# EAGLE design ProtoShieldMegaU (EAGLE 5.10)
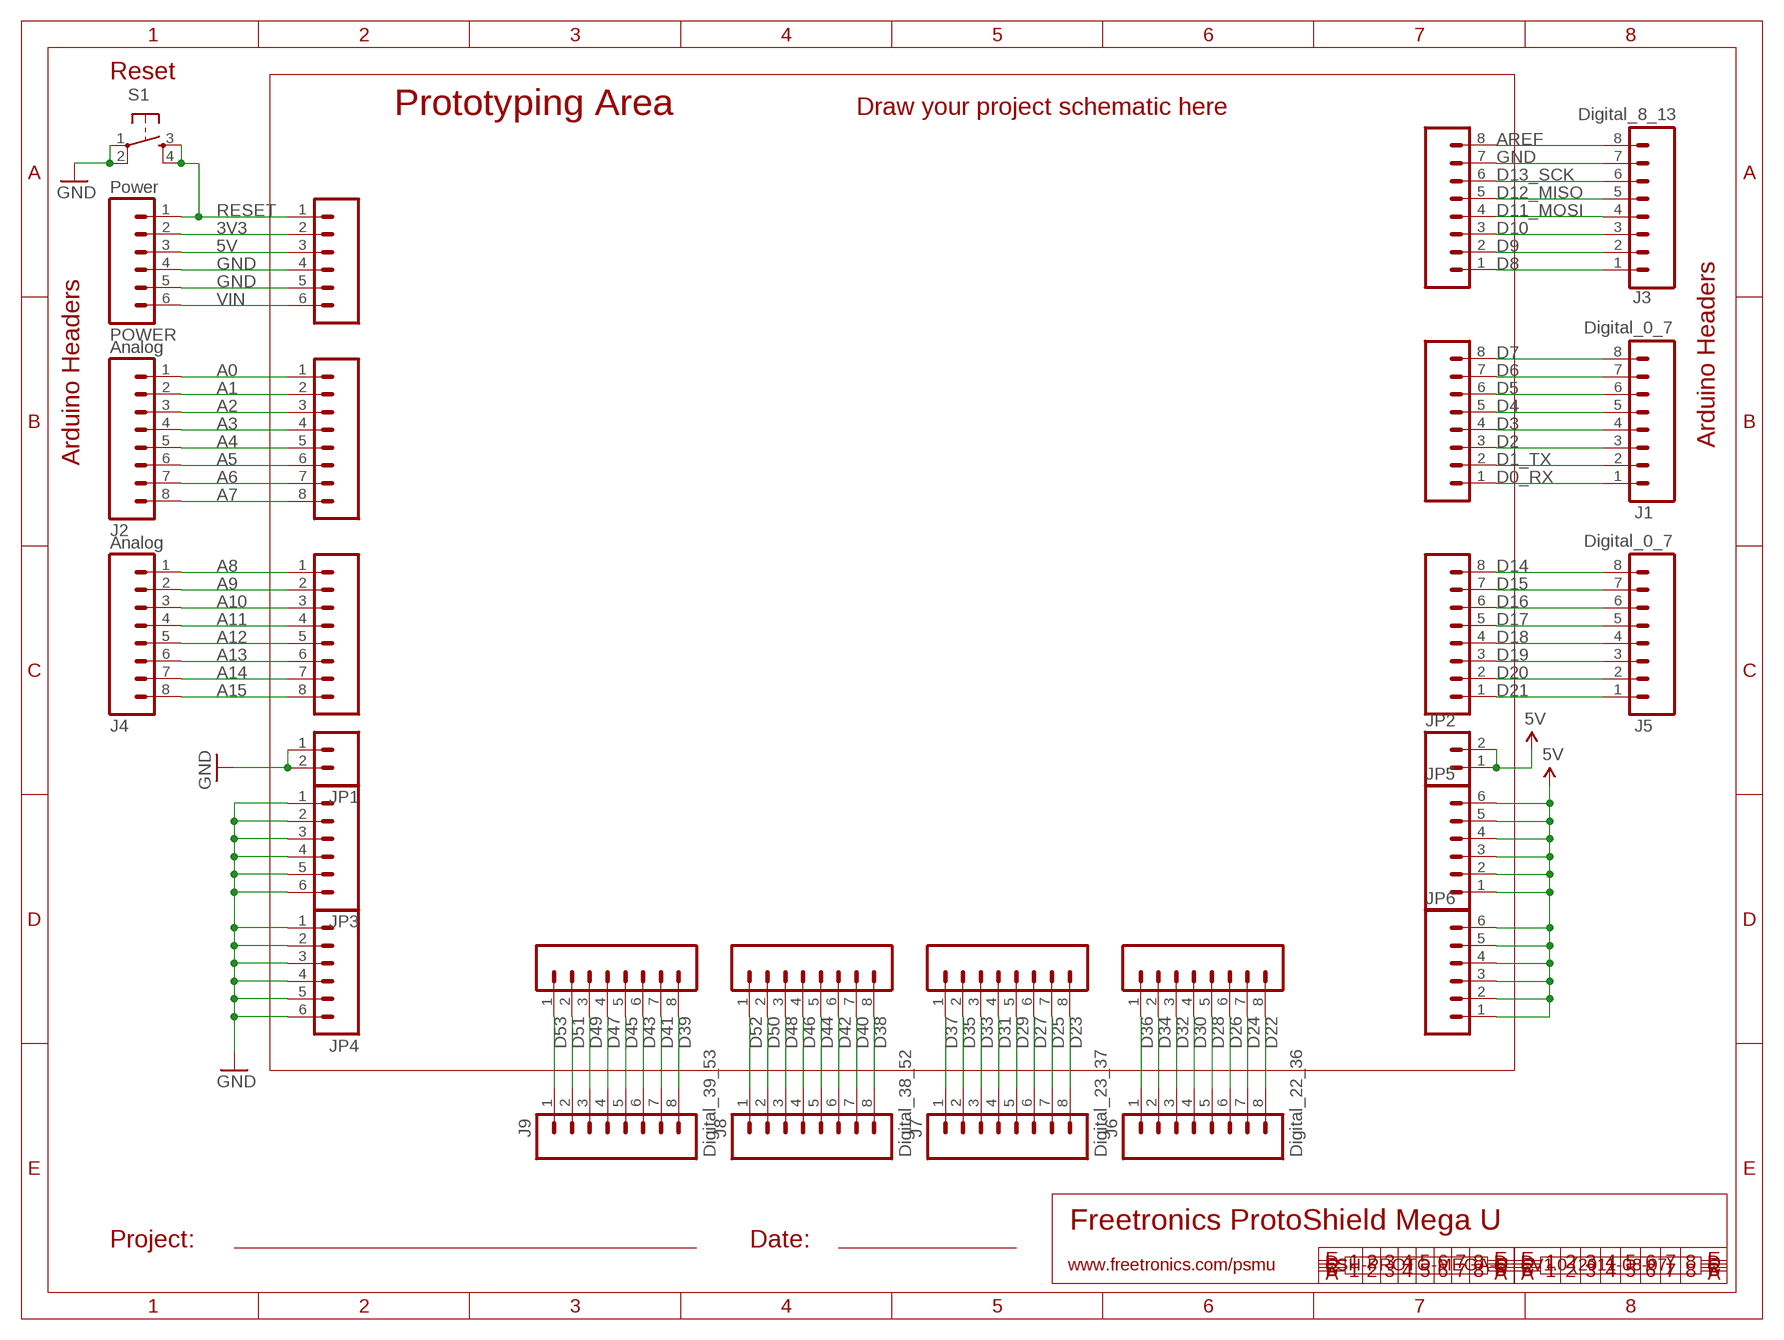
[diagram p0: schematic, sheet 1]

## Parts
J1  Digital_0_7  M08  [1X08]
J2  Analog  M08  [1X08]
J3  Digital_8_13  M08  [1X08]
J4  Analog  M08  [1X08]
J5  Digital_0_7  M08  [1X08]
J6  Digital_22_36  M08  [1X08]
J7  Digital_23_37  M08  [1X08]
J8  Digital_38_52  M08  [1X08]
J9  Digital_39_53  M08  [1X08]
JP1  M02PTH  [1X02]
JP2  M02PTH  [1X02]
JP3  M06SIP  [1X06]
JP4  M06SIP  [1X06]
JP5  M06SIP  [1X06]
JP6  M06SIP  [1X06]
POWER  Power  M06SIP  [1X06]
S1  TAC_SWITCHPTH  [TACTILE-PTH]
SL1  Digital_0_7  M08  [1X08]
SL2  Analog  M08  [1X08]
SL3  Digital_8_13  M08  [1X08]
SL4  Analog  M08  [1X08]
SL5  Digital_0_7  M08  [1X08]
SL6  Digital_0_7  M08  [1X08]
SL7  Digital_0_7  M08  [1X08]
SL8  Digital_0_7  M08  [1X08]
SL9  Digital_0_7  M08  [1X08]
SLP  Power  M06SIP  [1X06]

## Nets
3V3: POWER.2 SLP.2
5V: JP2.1 JP2.2 JP5.1 JP5.2 JP5.3 JP5.4 JP5.5 JP5.6 JP6.1 JP6.2 JP6.3 JP6.4 JP6.5 JP6.6 POWER.3 SLP.3
A0: J2.1 SL2.1
A1: J2.2 SL2.2
A2: J2.3 SL2.3
A3: J2.4 SL2.4
A4: J2.5 SL2.5
A5: J2.6 SL2.6
A6: J2.7 SL2.7
A7: J2.8 SL2.8
A8: J4.1 SL4.1
A9: J4.2 SL4.2
A10: J4.3 SL4.3
A11: J4.4 SL4.4
A12: J4.5 SL4.5
A13: J4.6 SL4.6
A14: J4.7 SL4.7
A15: J4.8 SL4.8
AREF: J3.8 SL3.8
D0_RX: J1.1 SL1.1
D1_TX: J1.2 SL1.2
D2: J1.3 SL1.3
D3: J1.4 SL1.4
D4: J1.5 SL1.5
D5: J1.6 SL1.6
D6: J1.7 SL1.7
D7: J1.8 SL1.8
D8: J3.1 SL3.1
D9: J3.2 SL3.2
D10: J3.3 SL3.3
D11_MOSI: J3.4 SL3.4
D12_MISO: J3.5 SL3.5
D13_SCK: J3.6 SL3.6
D14: J5.8 SL5.8
D15: J5.7 SL5.7
D16: J5.6 SL5.6
D17: J5.5 SL5.5
D18: J5.4 SL5.4
D19: J5.3 SL5.3
D20: J5.2 SL5.2
D21: J5.1 SL5.1
D22: J6.8 SL6.8
D23: J7.8 SL7.8
D24: J6.7 SL6.7
D25: J7.7 SL7.7
D26: J6.6 SL6.6
D27: J7.6 SL7.6
D28: J6.5 SL6.5
D29: J7.5 SL7.5
D30: J6.4 SL6.4
D31: J7.4 SL7.4
D32: J6.3 SL6.3
D33: J7.3 SL7.3
D34: J6.2 SL6.2
D35: J7.2 SL7.2
D36: J6.1 SL6.1
D37: J7.1 SL7.1
D38: J8.8 SL8.8
D39: J9.8 SL9.8
D40: J8.7 SL8.7
D41: J9.7 SL9.7
D42: J8.6 SL8.6
D43: J9.6 SL9.6
D44: J8.5 SL8.5
D45: J9.5 SL9.5
D46: J8.4 SL8.4
D47: J9.4 SL9.4
D48: J8.3 SL8.3
D49: J9.3 SL9.3
D50: J8.2 SL8.2
D51: J9.2 SL9.2
D52: J8.1 SL8.1
D53: J9.1 SL9.1
GND: J3.7 JP1.1 JP1.2 JP3.1 JP3.2 JP3.3 JP3.4 JP3.5 JP3.6 JP4.1 JP4.2 JP4.3 JP4.4 JP4.5 JP4.6 POWER.4 POWER.5 S1.1 S1.2 SL3.7 SLP.4 SLP.5
RESET: POWER.1 S1.3 S1.4 SLP.1
VIN: POWER.6 SLP.6

## Notes on the sheet
- Reset
- Prototyping Area | Draw your project schematic here
- Arduino Headers
- Arduino Headers
- Freetronics ProtoShield Mega U
- Project: | Date:
- www.freetronics.com/psmu | SH-PROTO-MEGA-U | V1.0 (2011-08-07)

## Library data of the parts
J1 J3 J5-J9 SL1 SL3 SL5-SL9 = freetronics:M08: Header 8 Standard 8-pin 0.1" header. Use with straight break away headers (SKU : PRT-00116), right angle break away headers (PRT-00553), swiss pins (PRT-00743), machine pins (PRT-00117), and female headers (PRT-00115).
J2 J4 SL2 SL4 = freetronics-master-v1:M08: Header 8 Standard 8-pin 0.1" header. Use with straight break away headers (SKU : PRT-00116), right angle break away headers (PRT-00553), swiss pins (PRT-00743), machine pins (PRT-00117), and female headers (PRT-00115).
JP1 JP2 = freetronics-master-v1:M02: Header 2 Standard 2-pin 0.1" header. Use with straight break away headers (SKU : PRT-00116), right angle break away headers (PRT-00553), swiss pins (PRT-00743), machine pins (PRT-00117), and female headers (PRT-00115). Molex polarized connector foot print use with SKU : PRT-08233 with associated crimp pins and housings.
JP3-JP6 = freetronics-master-v1:M06: Header 6 Standard 6-pin 0.1" header. Use with straight break away headers (SKU : PRT-00116), right angle break away headers (PRT-00553), swiss pins (PRT-00743), machine pins (PRT-00117), and female headers (PRT-00115). Molex polarized connector foot print use with SKU : PRT-08094 with associated crimp pins and housings. NOTES ON THE VARIANTS LOCK and LOCK_LONGPADS... This footprint was designed to help hold the alignment of a through-hole component (i.e. 6-pin header) while soldering it into place. You may notice that each hole has been shifted either up or down by 0.005 of an inch from it's more standard position (which is a perfectly straight line). This slight alteration caused the pins (the squares in the middle) to touch the edges of the holes. Because they are alternating, it causes a "brace" to hold the component in place. 0.005 has proven to be the perfect amount of "off-center" position when using our standard breakaway headers. Although looks a little odd when you look at the bare footprint, once you have a header in there, the alteration is very hard to notice. Also, if you push a header all the way into place, it is covered up entirely on the bottom side. This idea of altering the position of holes to aid alignment will be further integrated into the Sparkfun Library for other footprints. It can help hold any component with 3 or more connection pins.
POWER SLP = freetronics:M06: Header 6 Standard 6-pin 0.1" header. Use with straight break away headers (SKU : PRT-00116), right angle break away headers (PRT-00553), swiss pins (PRT-00743), machine pins (PRT-00117), and female headers (PRT-00115). Molex polarized connector foot print use with SKU : PRT-08094 with associated crimp pins and housings. NOTES ON THE VARIANTS LOCK and LOCK_LONGPADS... This footprint was designed to help hold the alignment of a through-hole component (i.e. 6-pin header) while soldering it into place. You may notice that each hole has been shifted either up or down by 0.005 of an inch from it's more standard position (which is a perfectly straight line). This slight alteration caused the pins (the squares in the middle) to touch the edges of the holes. Because they are alternating, it causes a "brace" to hold the component in place. 0.005 has proven to be the perfect amount of "off-center" position when using our standard breakaway headers. Although looks a little odd when you look at the bare footprint, once you have a header in there, the alteration is very hard to notice. Also, if you push a header all the way into place, it is covered up entirely on the bottom side. This idea of altering the position of holes to aid alignment will be further integrated into the Sparkfun Library for other footprints. It can help hold any component with 3 or more connection pins.
S1 = freetronics-master-v1:TAC_SWITCH: Momentary Switch Button commonly used for reset or general input. Spark Fun Electronics SKU : COM-00097

## Board
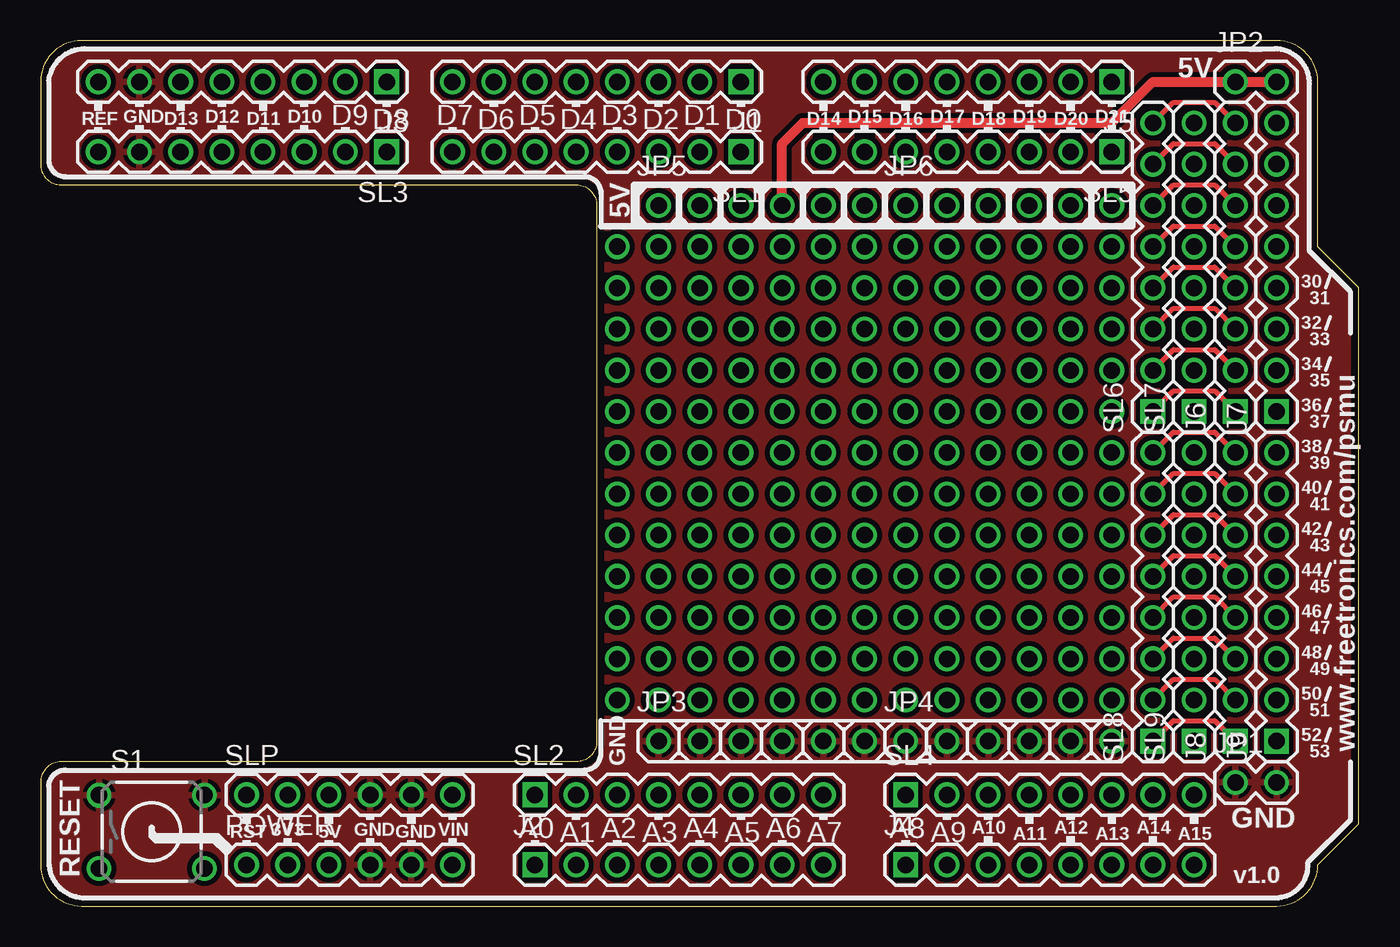
[diagram p1: board, top side]
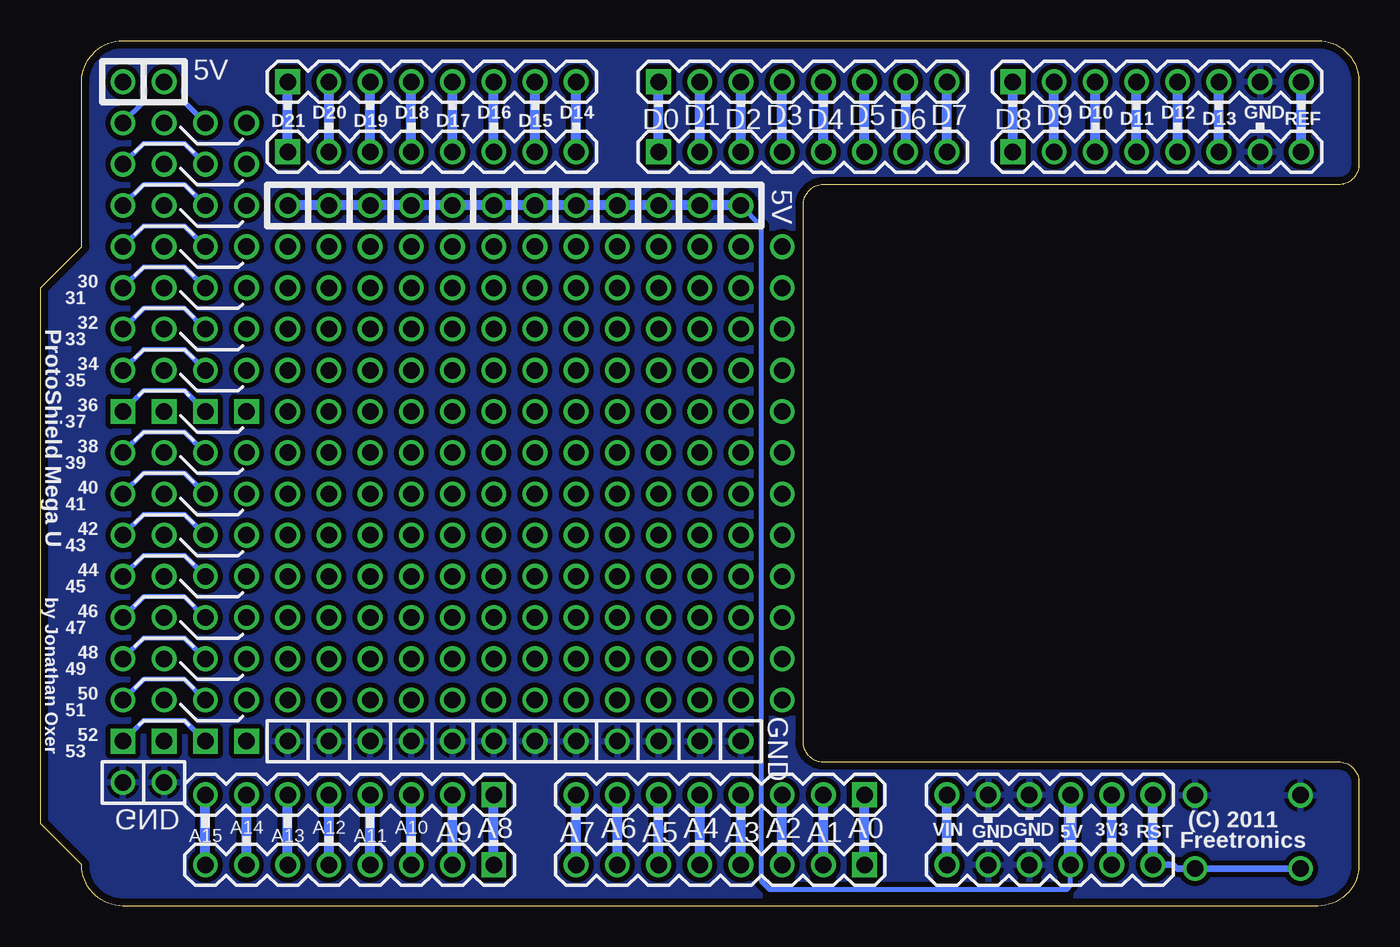
[diagram p2: board, bottom side, seen from below]

Size 81.28 x 53.34 mm. Coordinates in mm from the lower left corner, seen from the top.
Outline: 0,2.54 arc90 2.54,0 76.2,0 arc90 78.74,2.54 81.28,5.08 81.28,38.1 78.74,40.64 78.74,50.8 arc90 76.2,53.34 2.54,53.34 arc90 0,50.8 0,45.72 arc90 1.27,44.45 33.02,44.45 arc-90 34.29,43.18 34.29,10.16 arc-90 33.02,8.89 1.27,8.89 arc90 0,7.62 0,2.54
Copper layers (1*16): Top 0.035mm / dielectric 1.5mm / Bottom 0.035mm
Design rules "default *": minimum track width 10mil, minimum drill 24mil, track to track 12mil, track to pad 12mil, pad to pad 12mil, via to via 12mil, smd to smd 8mil, copper to edge 18mil, drill to drill 8mil, minimum pad ring 10mil, minimum via ring 8mil, stop-mask expansion 4mil, vias tented up to drill 0mil, thermal gap 10mil

### Footprints (pad centres in the part's own frame; a part is rotated, then mirrored left to right if it is on the bottom)
1X08 = drill 1.016 square: 1 0,0 | drill 1.016 round: 2 2.54,0; 3 5.08,0; 4 7.62,0; 5 10.16,0; 6 12.7,0; 7 15.24,0; 8 17.78,0
1X02 = drill 1.016 round: 1 0,0; 2 2.54,0
1X06 = drill 1.016 round: 1 0,0; 2 2.54,0; 3 5.08,0; 4 7.62,0; 5 10.16,0; 6 12.7,0
TACTILE-PTH = drill 1.016 round: 1 -3.251,2.261; 2 3.251,2.261; 3 -3.251,-2.261; 4 3.251,-2.261

### Placement (x,y rotation side)
J1  43.18,50.8 180 top
J2  30.48,2.54 0 top
J3  21.34,50.8 180 top
J4  53.34,2.54 0 top
J5  66.04,50.8 180 top
J6  73.66,30.48 90 top
J7  76.2,30.48 90 top
J8  73.66,10.16 90 top
J9  76.2,10.16 90 top
JP1  73.66,7.62 0 top
JP2  73.66,50.8 0 top
JP3  38.1,10.16 0 top
JP4  53.34,10.16 0 top
JP5  38.1,43.18 0 top
JP6  53.34,43.18 0 top
POWER  12.7,2.54 0 top
S1  6.86,4.57 0 top
SL1  43.18,46.48 180 top
SL2  30.48,6.86 0 top
SL3  21.34,46.48 180 top
SL4  53.34,6.86 0 top
SL5  66.04,46.48 180 top
SL6  68.58,30.48 90 top
SL7  71.12,30.48 90 top
SL8  68.58,10.16 90 top
SL9  71.12,10.16 90 top
SLP  12.7,6.86 0 top

### Tracks (layer width: path | path; a pad name or v marks a point on that pad's centre or on a via)
3V3
  Bottom 0.61: POWER.2 SLP.2
5V
  Top 0.61: JP2.2 JP2.1 68.58,50.8 66.04,48.26 46.99,48.26 45.72,46.99 JP5.4
  Bottom 0.305: JP5.1 36.83,41.91 36.83,1.52 36.32,1.02 18.03,1.02 17.78,1.27 POWER.3
  Bottom 0.61: JP5.1 JP5.2 JP5.3 JP5.4 JP5.5 JP5.6 JP6.1 JP6.2 JP6.3 JP6.4 JP6.5 JP6.6
  Bottom 0.813: POWER.3 SLP.3
A0
  Bottom 0.61: J2.1 SL2.1
A1
  Bottom 0.61: J2.2 SL2.2
A2
  Bottom 0.61: J2.3 SL2.3
A3
  Bottom 0.61: J2.4 SL2.4
A4
  Bottom 0.61: J2.5 SL2.5
A5
  Bottom 0.61: J2.6 SL2.6
A6
  Bottom 0.61: J2.7 SL2.7
A7
  Bottom 0.61: J2.8 SL2.8
A8
  Bottom 0.61: J4.1 SL4.1
A9
  Bottom 0.61: J4.2 SL4.2
A10
  Bottom 0.61: J4.3 SL4.3
A11
  Bottom 0.61: J4.4 SL4.4
A12
  Bottom 0.61: J4.5 SL4.5
A13
  Bottom 0.61: J4.6 SL4.6
A14
  Bottom 0.61: J4.7 SL4.7
A15
  Bottom 0.61: J4.8 SL4.8
AREF
  Bottom 0.61: SL3.8 J3.8
D0_RX
  Bottom 0.61: SL1.1 J1.1
D1_TX
  Bottom 0.61: SL1.2 J1.2
D2
  Bottom 0.61: SL1.3 J1.3
D3
  Bottom 0.61: SL1.4 J1.4
D4
  Bottom 0.61: SL1.5 J1.5
D5
  Bottom 0.61: SL1.6 J1.6
D6
  Bottom 0.61: SL1.7 J1.7
D7
  Bottom 0.61: SL1.8 J1.8
D8
  Bottom 0.61: SL3.1 J3.1
D9
  Bottom 0.61: SL3.2 J3.2
D10
  Bottom 0.61: SL3.3 J3.3
D11_MOSI
  Bottom 0.61: SL3.4 J3.4
D12_MISO
  Bottom 0.61: SL3.5 J3.5
D13_SCK
  Bottom 0.61: SL3.6 J3.6
D14
  Bottom 0.61: SL5.8 J5.8
D15
  Bottom 0.61: SL5.7 J5.7
D16
  Bottom 0.61: SL5.6 J5.6
D17
  Bottom 0.61: SL5.5 J5.5
D18
  Bottom 0.61: SL5.4 J5.4
D19
  Bottom 0.61: SL5.3 J5.3
D20
  Bottom 0.61: SL5.2 J5.2
D21
  Bottom 0.61: SL5.1 J5.1
D22
  Top 0.305: J6.8 72.39,49.53 69.85,49.53 SL6.8
D23
  Bottom 0.305: J7.8 74.93,49.53 72.39,49.53 SL7.8
D24
  Top 0.305: J6.7 72.39,46.99 69.85,46.99 SL6.7
D25
  Bottom 0.305: J7.7 74.93,46.99 72.39,46.99 SL7.7
D26
  Top 0.305: J6.6 72.39,44.45 69.85,44.45 SL6.6
D27
  Bottom 0.305: J7.6 74.93,44.45 72.39,44.45 SL7.6
D28
  Top 0.305: J6.5 72.39,41.91 69.85,41.91 SL6.5
D29
  Bottom 0.305: J7.5 74.93,41.91 72.39,41.91 SL7.5
D30
  Top 0.305: J6.4 72.39,39.37 69.85,39.37 SL6.4
D31
  Bottom 0.305: J7.4 74.93,39.37 72.39,39.37 SL7.4
D32
  Top 0.305: J6.3 72.39,36.83 69.85,36.83 SL6.3
D33
  Bottom 0.305: J7.3 74.93,36.83 72.39,36.83 SL7.3
D34
  Top 0.305: J6.2 72.39,34.29 69.85,34.29 SL6.2
D35
  Bottom 0.305: J7.2 74.93,34.29 72.39,34.29 SL7.2
D36
  Top 0.305: J6.1 72.39,31.75 69.85,31.75 SL6.1
D37
  Bottom 0.305: J7.1 74.93,31.75 72.39,31.75 SL7.1
D38
  Top 0.305: J8.8 72.39,29.21 69.85,29.21 SL8.8
D39
  Bottom 0.305: J9.8 74.93,29.21 72.39,29.21 SL9.8
D40
  Top 0.305: J8.7 72.39,26.67 69.85,26.67 SL8.7
D41
  Bottom 0.305: J9.7 74.93,26.67 72.39,26.67 SL9.7
D42
  Top 0.305: J8.6 72.39,24.13 69.85,24.13 SL8.6
D43
  Bottom 0.305: J9.6 74.93,24.13 72.39,24.13 SL9.6
D44
  Top 0.305: J8.5 72.39,21.59 69.85,21.59 SL8.5
D45
  Bottom 0.305: J9.5 74.93,21.59 72.39,21.59 SL9.5
D46
  Top 0.305: J8.4 72.39,19.05 69.85,19.05 SL8.4
D47
  Bottom 0.305: J9.4 74.93,19.05 72.39,19.05 SL9.4
D48
  Top 0.305: J8.3 72.39,16.51 69.85,16.51 SL8.3
D49
  Bottom 0.305: J9.3 74.93,16.51 72.39,16.51 SL9.3
D50
  Top 0.305: J8.2 72.39,13.97 69.85,13.97 SL8.2
D51
  Bottom 0.305: J9.2 74.93,13.97 72.39,13.97 SL9.2
D52
  Top 0.305: J8.1 72.39,11.43 69.85,11.43 SL8.1
D53
  Bottom 0.305: J9.1 74.93,11.43 72.39,11.43 SL9.1
GND
  pour Bottom: 0,50.8 arc-74 2.54,53.34 76.2,53.34 arc-74 78.74,50.8 78.74,40.64 81.28,38.1 81.28,5.08 78.74,2.54 arc-74 76.2,0 1.27,0 arc-74 0,2.54 0,7.62 arc-90 1.27,8.89 33.02,8.89 arc90 34.29,10.16 34.29,43.18 arc90 33.02,44.45 1.27,44.45 arc-90 0,45.72
  pour Top: 0,50.8 arc-74 2.54,53.34 76.2,53.34 arc-74 78.74,50.8 78.74,40.64 81.28,38.1 81.28,5.08 78.74,2.54 arc-74 76.2,0 1.27,0 arc-74 0,2.54 0,7.62 arc-90 1.27,8.89 33.02,8.89 arc90 34.29,10.16 34.29,43.18 arc90 33.02,44.45 1.27,44.45 arc-90 0,45.72
N$5  (via drill 1.02)
  other vias: 38.1,15.24
N$6  (via drill 1.02)
  other vias: 43.18,40.64
N$7  (via drill 1.02)
  other vias: 35.56,15.24
N$8  (via drill 1.02)
  other vias: 43.18,12.7
N$10  (via drill 1.02)
  other vias: 45.72,12.7
N$11  (via drill 1.02)
  other vias: 45.72,15.24
N$12  (via drill 1.02)
  other vias: 45.72,17.78
N$13  (via drill 1.02)
  other vias: 45.72,20.32
N$14  (via drill 1.02)
  other vias: 45.72,22.86
N$15  (via drill 1.02)
  other vias: 45.72,25.4
N$16  (via drill 1.02)
  other vias: 45.72,27.94
N$17  (via drill 1.02)
  other vias: 45.72,30.48
N$18  (via drill 1.02)
  other vias: 45.72,33.02
N$19  (via drill 1.02)
  other vias: 45.72,35.56
N$20  (via drill 1.02)
  other vias: 45.72,38.1
N$22  (via drill 1.02)
  other vias: 38.1,17.78
N$23  (via drill 1.02)
  other vias: 35.56,17.78
N$24  (via drill 1.02)
  other vias: 40.64,12.7
N$25  (via drill 1.02)
  other vias: 45.72,40.64
N$27  (via drill 1.02)
  other vias: 50.8,15.24
N$28  (via drill 1.02)
  other vias: 48.26,15.24
N$29  (via drill 1.02)
  other vias: 55.88,12.7
N$30  (via drill 1.02)
  other vias: 50.8,17.78
N$31  (via drill 1.02)
  other vias: 48.26,17.78
N$32  (via drill 1.02)
  other vias: 53.34,12.7
N$33  (via drill 1.02)
  other vias: 50.8,20.32
N$34  (via drill 1.02)
  other vias: 48.26,20.32
N$35  (via drill 1.02)
  other vias: 50.8,12.7
N$36  (via drill 1.02)
  other vias: 50.8,22.86
N$37  (via drill 1.02)
  other vias: 48.26,22.86
N$38  (via drill 1.02)
  other vias: 38.1,20.32
N$39  (via drill 1.02)
  other vias: 35.56,20.32
N$40  (via drill 1.02)
  other vias: 38.1,12.7
N$41  (via drill 1.02)
  other vias: 48.26,12.7
N$42  (via drill 1.02)
  other vias: 50.8,25.4
N$43  (via drill 1.02)
  other vias: 48.26,25.4
N$44  (via drill 1.02)
  other vias: 50.8,27.94
N$45  (via drill 1.02)
  other vias: 48.26,27.94
N$46  (via drill 1.02)
  other vias: 50.8,30.48
N$47  (via drill 1.02)
  other vias: 48.26,30.48
N$48  (via drill 1.02)
  other vias: 50.8,33.02
N$49  (via drill 1.02)
  other vias: 48.26,33.02
N$50  (via drill 1.02)
  other vias: 50.8,35.56
N$51  (via drill 1.02)
  other vias: 48.26,35.56
N$53  (via drill 1.02)
  other vias: 50.8,38.1
N$54  (via drill 1.02)
  other vias: 38.1,22.86
N$55  (via drill 1.02)
  other vias: 35.56,22.86
N$56  (via drill 1.02)
  other vias: 35.56,12.7
N$57  (via drill 1.02)
  other vias: 48.26,38.1
N$59  (via drill 1.02)
  other vias: 50.8,40.64
N$60  (via drill 1.02)
  other vias: 48.26,40.64
N$62  (via drill 1.02)
  other vias: 53.34,15.24
N$63  (via drill 1.02)
  other vias: 53.34,17.78
N$64  (via drill 1.02)
  other vias: 53.34,20.32
N$65  (via drill 1.02)
  other vias: 53.34,22.86
N$66  (via drill 1.02)
  other vias: 53.34,25.4
N$67  (via drill 1.02)
  other vias: 53.34,27.94
N$68  (via drill 1.02)
  other vias: 53.34,30.48
N$69  (via drill 1.02)
  other vias: 53.34,33.02
N$70  (via drill 1.02)
  other vias: 38.1,25.4
N$71  (via drill 1.02)
  other vias: 35.56,25.4
N$72  (via drill 1.02)
  other vias: 53.34,35.56
N$73  (via drill 1.02)
  other vias: 53.34,38.1
N$74  (via drill 1.02)
  other vias: 55.88,15.24
N$75  (via drill 1.02)
  other vias: 55.88,17.78
N$76  (via drill 1.02)
  other vias: 55.88,20.32
N$77  (via drill 1.02)
  other vias: 55.88,22.86
N$78  (via drill 1.02)
  other vias: 55.88,25.4
N$79  (via drill 1.02)
  other vias: 55.88,27.94
N$80  (via drill 1.02)
  other vias: 55.88,30.48
N$81  (via drill 1.02)
  other vias: 55.88,33.02
N$82  (via drill 1.02)
  other vias: 55.88,35.56
N$83  (via drill 1.02)
  other vias: 55.88,38.1
N$84  (via drill 1.02)
  other vias: 53.34,40.64
N$86  (via drill 1.02)
  other vias: 38.1,27.94
N$87  (via drill 1.02)
  other vias: 35.56,27.94
N$91  (via drill 1.02)
  other vias: 55.88,40.64
N$93  (via drill 1.02)
  other vias: 58.42,12.7
N$94  (via drill 1.02)
  other vias: 58.42,15.24
N$95  (via drill 1.02)
  other vias: 58.42,17.78
N$96  (via drill 1.02)
  other vias: 58.42,20.32
N$97  (via drill 1.02)
  other vias: 58.42,22.86
N$98  (via drill 1.02)
  other vias: 58.42,25.4
N$99  (via drill 1.02)
  other vias: 58.42,27.94
N$100  (via drill 1.02)
  other vias: 58.42,30.48
N$101  (via drill 1.02)
  other vias: 58.42,33.02
N$102  (via drill 1.02)
  other vias: 38.1,30.48
N$103  (via drill 1.02)
  other vias: 35.56,30.48
N$104  (via drill 1.02)
  other vias: 58.42,35.56
N$105  (via drill 1.02)
  other vias: 58.42,38.1
N$107  (via drill 1.02)
  other vias: 58.42,40.64
N$109  (via drill 1.02)
  other vias: 63.5,12.7
N$110  (via drill 1.02)
  other vias: 60.96,12.7
N$112  (via drill 1.02)
  other vias: 60.96,15.24
N$113  (via drill 1.02)
  other vias: 60.96,17.78
N$114  (via drill 1.02)
  other vias: 60.96,20.32
N$115  (via drill 1.02)
  other vias: 60.96,22.86
N$116  (via drill 1.02)
  other vias: 60.96,25.4
N$117  (via drill 1.02)
  other vias: 60.96,27.94
N$118  (via drill 1.02)
  other vias: 38.1,33.02
N$119  (via drill 1.02)
  other vias: 35.56,33.02
N$120  (via drill 1.02)
  other vias: 60.96,30.48
N$121  (via drill 1.02)
  other vias: 60.96,33.02
N$122  (via drill 1.02)
  other vias: 60.96,35.56
N$123  (via drill 1.02)
  other vias: 60.96,38.1
N$124  (via drill 1.02)
  other vias: 63.5,15.24
N$125  (via drill 1.02)
  other vias: 63.5,17.78
N$126  (via drill 1.02)
  other vias: 63.5,20.32
N$127  (via drill 1.02)
  other vias: 63.5,22.86
N$128  (via drill 1.02)
  other vias: 63.5,25.4
N$129  (via drill 1.02)
  other vias: 63.5,27.94
N$130  (via drill 1.02)
  other vias: 63.5,30.48
N$131  (via drill 1.02)
  other vias: 63.5,33.02
N$132  (via drill 1.02)
  other vias: 63.5,35.56
N$133  (via drill 1.02)
  other vias: 63.5,38.1
N$134  (via drill 1.02)
  other vias: 38.1,35.56
N$135  (via drill 1.02)
  other vias: 35.56,35.56
N$137  (via drill 1.02)
  other vias: 60.96,40.64
N$140  (via drill 1.02)
  other vias: 63.5,40.64
N$142  (via drill 1.02)
  other vias: 66.04,12.7
N$143  (via drill 1.02)
  other vias: 66.04,15.24
N$144  (via drill 1.02)
  other vias: 66.04,17.78
N$145  (via drill 1.02)
  other vias: 66.04,20.32
N$146  (via drill 1.02)
  other vias: 66.04,22.86
N$147  (via drill 1.02)
  other vias: 66.04,25.4
N$148  (via drill 1.02)
  other vias: 66.04,27.94
N$149  (via drill 1.02)
  other vias: 66.04,30.48
N$150  (via drill 1.02)
  other vias: 38.1,38.1
N$151  (via drill 1.02)
  other vias: 35.56,38.1
N$153  (via drill 1.02)
  other vias: 66.04,33.02
N$154  (via drill 1.02)
  other vias: 66.04,35.56
N$155  (via drill 1.02)
  other vias: 66.04,38.1
N$157  (via drill 1.02)
  other vias: 66.04,40.64
N$166  (via drill 1.02)
  other vias: 38.1,40.64
N$167  (via drill 1.02)
  other vias: 35.56,40.64
N$182  (via drill 1.02)
  other vias: 40.64,15.24
N$183  (via drill 1.02)
  other vias: 40.64,17.78
N$184  (via drill 1.02)
  other vias: 40.64,20.32
N$185  (via drill 1.02)
  other vias: 40.64,22.86
N$186  (via drill 1.02)
  other vias: 40.64,25.4
N$187  (via drill 1.02)
  other vias: 40.64,27.94
N$188  (via drill 1.02)
  other vias: 40.64,30.48
N$189  (via drill 1.02)
  other vias: 40.64,33.02
N$190  (via drill 1.02)
  other vias: 40.64,35.56
N$191  (via drill 1.02)
  other vias: 40.64,38.1
N$193  (via drill 1.02)
  other vias: 43.18,15.24
N$194  (via drill 1.02)
  other vias: 43.18,17.78
N$195  (via drill 1.02)
  other vias: 43.18,20.32
N$196  (via drill 1.02)
  other vias: 43.18,22.86
N$197  (via drill 1.02)
  other vias: 43.18,25.4
N$198  (via drill 1.02)
  other vias: 43.18,27.94
N$199  (via drill 1.02)
  other vias: 43.18,30.48
N$200  (via drill 1.02)
  other vias: 43.18,33.02
N$201  (via drill 1.02)
  other vias: 43.18,35.56
N$202  (via drill 1.02)
  other vias: 43.18,38.1
N$203  (via drill 1.02)
  other vias: 40.64,40.64
RESET
  Bottom 0.406: S1.3 S1.4 11.2,2.31 11.43,2.54 POWER.1
  Bottom 0.61: POWER.1 SLP.1
VIN
  Bottom 0.61: POWER.6 SLP.6

### Text on the board
tPlace: 5V | REF | GND | D13 | D12 | D11 | D10 | D9 | D8 | D7 | D6 | D5 | D4 | D3 | D2 | D1 | D0 | D14 | D15 | D16 | D17 | D18 | D19 | D20 | D21 | 5V | 30 | 31 | 32 | 33 | 34 | 35 | 36 | 37 | 38 | 39 | 40 | 41 | 42 | 43 | 44 | 45 | 46 | 47 | 48 | 49 | 50 | 51 | 52 | www.freetronics.com/psmu | GND | 53 | GND | RST | 3V3 | 5V | GND | GND | VIN | A0 | A1 | A2 | A3 | A4 | A5 | A6 | A7 | A8 | A9 | A10 | A11 | A12 | A13 | A14 | A15 | RESET | v1.0
bPlace: 5V | GND | D12 | D10 | D14 | D16 | D18 | D20 | REF | D13 | D11 | D9 | D8 | D7 | D6 | D5 | D4 | D3 | D2 | D1 | D0 | D15 | D17 | D19 | D21 | 5V | 30 | 31 | 32 | ProtoShield Mega U | 33 | 34 | 35 | 36 | 37 | 38 | 39 | 40 | 41 | 42 | 43 | 44 | 45 | by Jonathan Oxer | 46 | 47 | 48 | 49 | 50 | GND | 51 | 52 | 53 | GND | (C) 2011 | Freetronics | RST | 3V3 | 5V | GND | GND | VIN | A0 | A1 | A2 | A3 | A4 | A5 | A6 | A7 | A8 | A9 | A10 | A11 | A12 | A13 | A14 | A15